# Altium schematic sheet schematic big.SchDoc
size A3; SheetNumber: 1; SheetTotal: 1
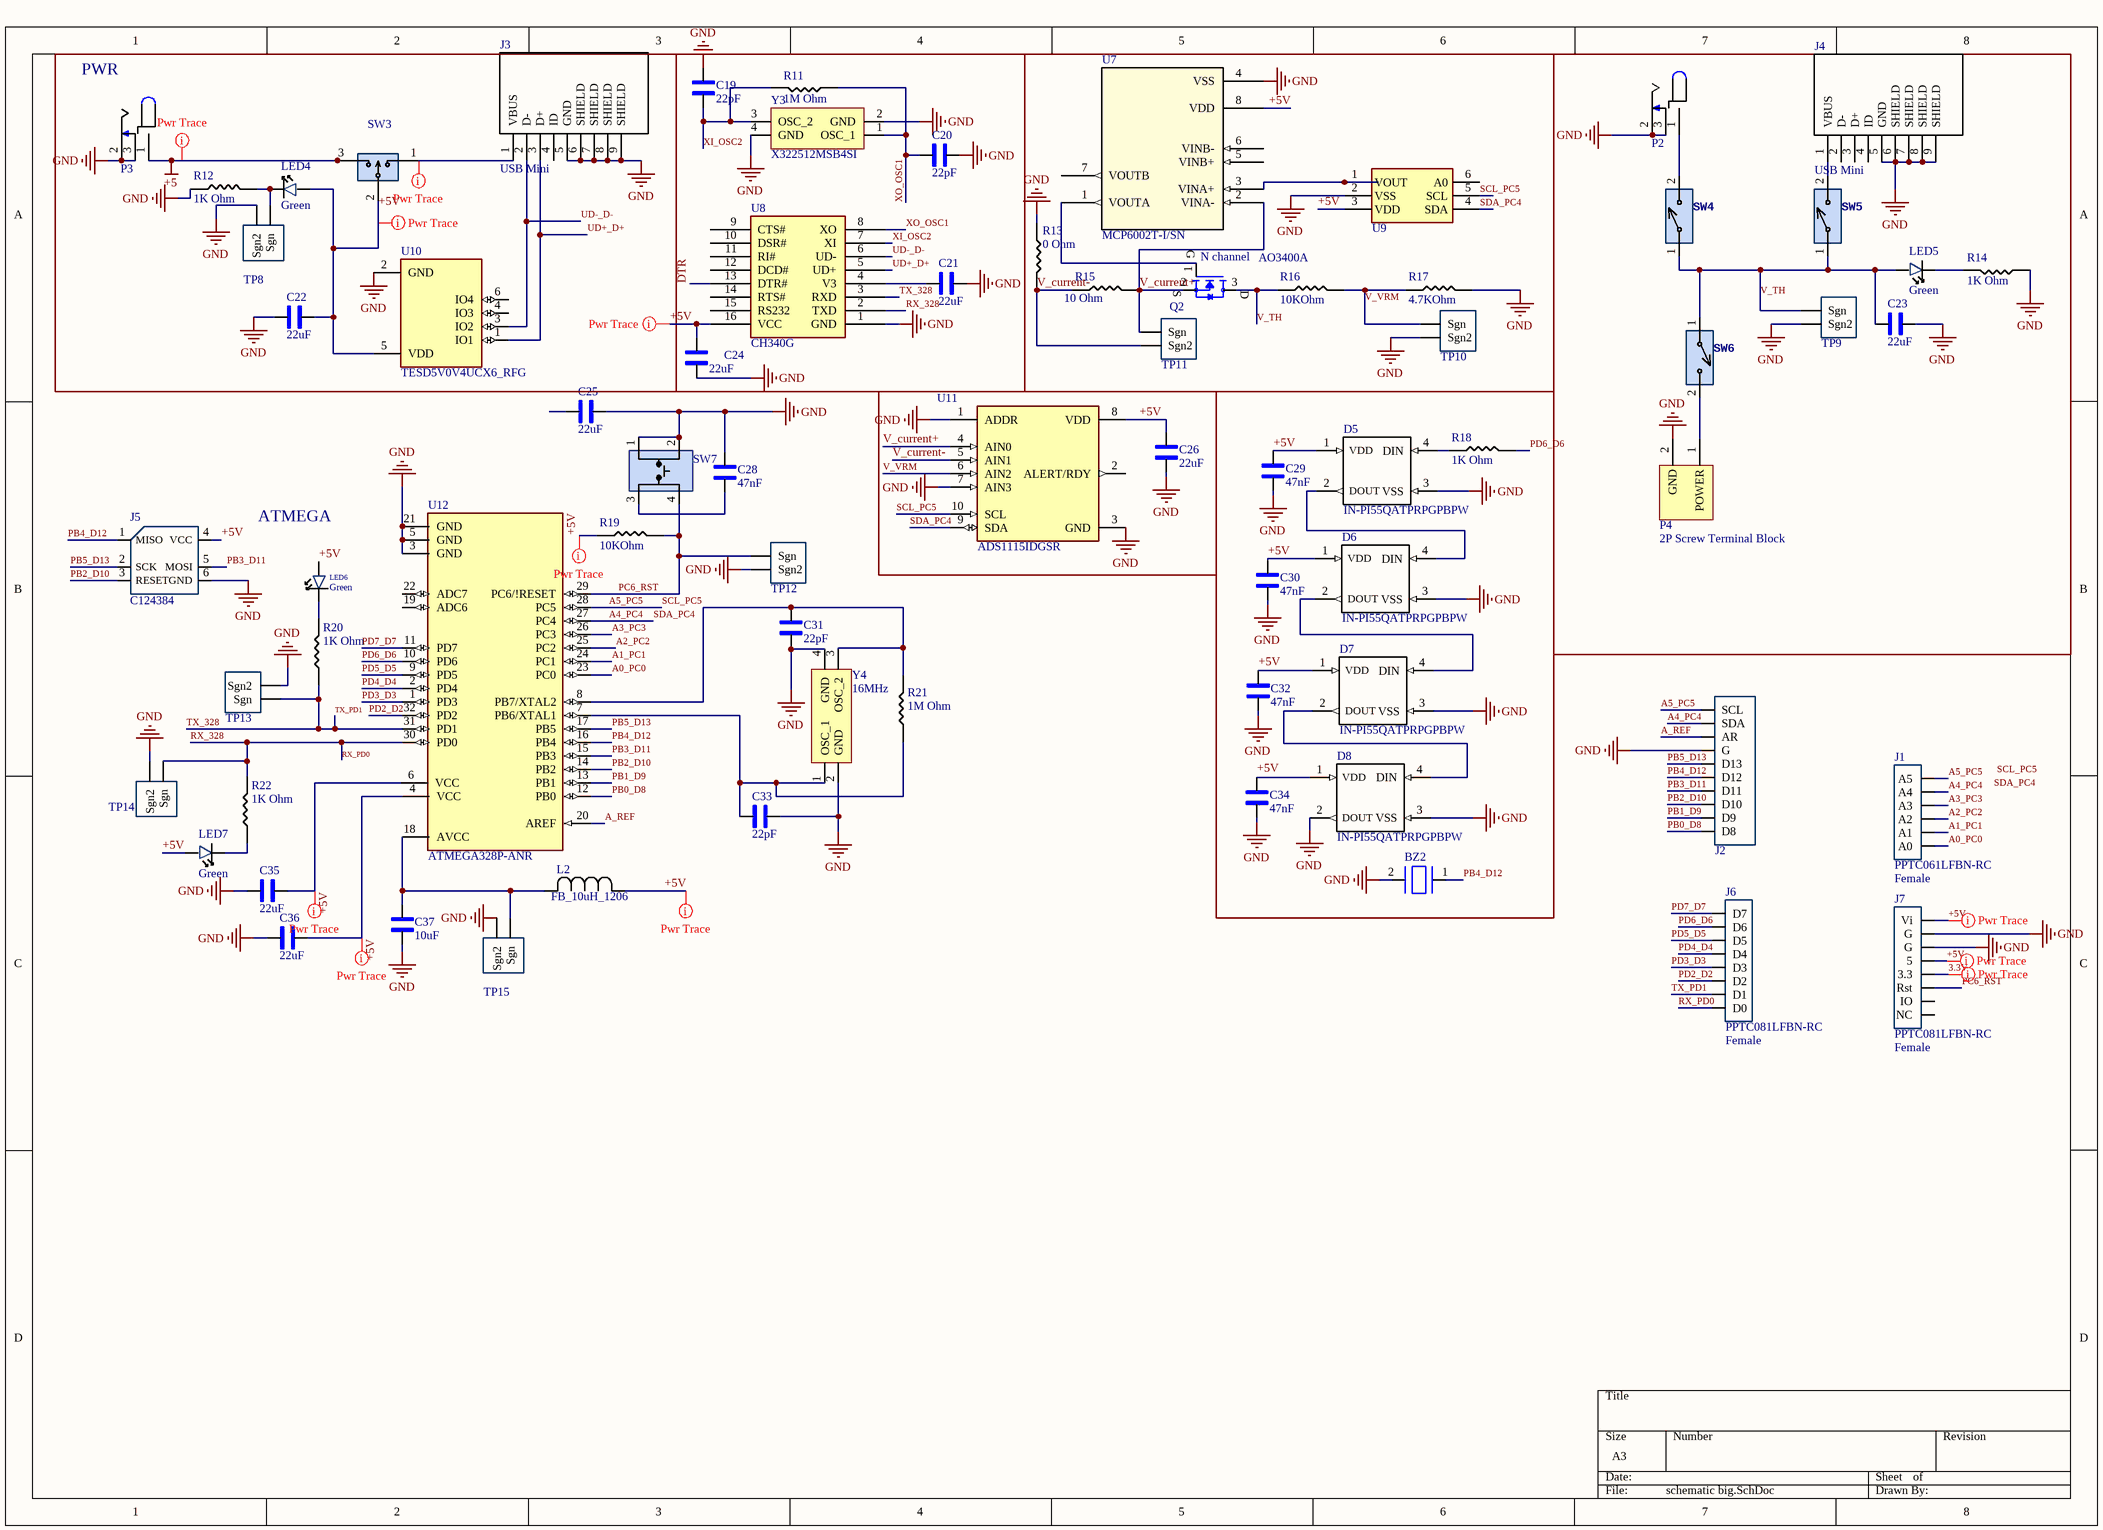
[diagram p0: schematic big.SchDoc]

## Parts
BZ2  AT-1224-TWT-5V-2-R  [BUZZER- TH]  (value not drawn)
C19  22pF  [1206_Passive_Capacitor]
C20  22pF  [1206_Passive_Capacitor]
C21  22uF  [1206_Passive_Capacitor]
C22  22uF  [1206_Passive_Capacitor]
C23  22uF  [1206_Passive_Capacitor]
C24  22uF  [1206_Passive_Capacitor]
C25  22uF  [1206_Passive_Capacitor]
C26  22uF  [1206_Passive_Capacitor]
C28  47nF  [1206_Passive_Capacitor]
C29  47nF  [1206_Passive_Capacitor]
C30  47nF  [1206_Passive_Capacitor]
C31  22pF  [1206_Passive_Capacitor]
C32  47nF  [1206_Passive_Capacitor]
C33  22pF  [1206_Passive_Capacitor]
C34  47nF  [1206_Passive_Capacitor]
C35  22uF  [1206_Passive_Capacitor]
C36  22uF  [1206_Passive_Capacitor]
C37  10uF  [1206_Passive_Capacitor]
D5  IN-PI55QATPRPGPBPW  [SERIAL_LED - duplicate]
D6  IN-PI55QATPRPGPBPW  [SERIAL_LED - duplicate]
D7  IN-PI55QATPRPGPBPW  [SERIAL_LED - duplicate]
D8  IN-PI55QATPRPGPBPW  [SERIAL_LED - duplicate]
J1  PPTC061LFBN-RC  value Female  [6_PIN_ARD-Analog_100mil]
J2  PPTC101LFBN-RC  [10_PIN_ARDUINO_100MIL]  (value not drawn)
J3  USB Mini  [USB_MINI_B]
J4  USB Mini  [USB_MINI_B]
J5  LCSC Part#: C124384  [ICSP]  (hidden comment: NRPN032PAEN-RC)
J6  PPTC081LFBN-RC  value Female  [8_PIN_ARD-DIG_100MIL]
J7  PPTC081LFBN-RC  value Female  [8_PIN_ARD-PWR_100MIL]
L2  FB_10uH_1206  [AIML-1206_ABR-M]
LED4  Green  [LED_1206]
LED5  Green  [LED_1206]
LED6  Green  [LED_1206]
LED7  Green  [LED_1206]
P2  Power Jack  [Power_Jack]  (value not drawn)
P3  Power Jack  [Power_Jack]  (value not drawn)
P4  2P Screw Terminal Block  [P_Terminal block 3.5mm-pitch]
Q2  AO3400A  value N channel  [N-MOSFET]
R11  value 1M Ohm  [1206_Passive_Resitor]  (hidden comment: 1M)
R12  value 1K Ohm  [1206_Passive_Resitor]  (hidden comment: 1k)
R13  0 Ohm  [1206_Passive_Resitor]
R14  value 1K Ohm  [1206_Passive_Resitor]  (hidden comment: 1k)
R15  10 Ohm  [1206_Passive_Resitor]
R16  value 10KOhm  [1206_Passive_Resitor]  (hidden comment: 10k)
R17  4.7KOhm  [1206_Passive_Resitor]
R18  value 1K Ohm  [1206_Passive_Resitor]  (hidden comment: 1k)
R19  value 10KOhm  [1206_Passive_Resitor]  (hidden comment: 10k)
R20  value 1K Ohm  [1206_Passive_Resitor]  (hidden comment: 1k)
R21  value 1M Ohm  [1206_Passive_Resitor]  (hidden comment: 1M)
R22  value 1K Ohm  [1206_Passive_Resitor]  (hidden comment: 1k)
SW3  PREC003SAAN-RC  [3_PIN_100mil]  (value not drawn)
SW4  SW_2Pin_100mil_Switch  [2Pin-Header-Conn]  (value not drawn)
SW5  SW_2Pin_100mil_Switch  [2Pin-Header-Conn]  (value not drawn)
SW6  SW_2Pin_100mil_Switch  [2Pin-Header-Conn]  (value not drawn)
SW7  TL3305AF160QG  [Switch_JLC]  (value not drawn)
TP8  10x Probe TP  [TP_Diff_Probe]  (value not drawn)
TP9  10x Probe TP  [TP_Diff_Probe]  (value not drawn)
TP10  10x Probe TP  [TP_Diff_Probe]  (value not drawn)
TP11  10x Probe TP  [TP_Diff_Probe]  (value not drawn)
TP12  10x Probe TP  [TP_Diff_Probe]  (value not drawn)
TP13  10x Probe TP  [TP_Diff_Probe]  (value not drawn)
TP14  10x Probe TP  [TP_Diff_Probe]  (value not drawn)
TP15  10x Probe TP  [TP_Diff_Probe]  (value not drawn)
U7  MCP6002T-I/SN  [SOIC127P600X175-8N]
U8  CH340G  [USB to serial]
U9  DAC IC  [MCP4725]  (value not drawn)
U10  TESD5V0V4UCX6_RFG  [SOT95P280X145-6N]
U11  ADS1115IDGSR  [ADC_ADS1115IDGSR]
U12  ATMEGA328P-ANR  [ATMega328P]
Y3  X322512MSB4SI  [Crystal resonator]
Y4  value 16MHz  [Crystal resonator]  (hidden comment: X322516MLB4SI)

## Blocks framed on the sheet
PWR: C22 J3 LED4 P3 R12 SW3 TP8 U10

## Nets
+5: P3.1 SW3.3
GND: BZ2.2(BZ2) C19.1 C20.2 C21.1 C22.1 C23.1 C24.1 C25.2 C26.1 C28.2 C29.1 C30.1 C31.1 C32.1 C33.1 C34.1 C35.1 C36.1 C37.1 D5.3(VSS) D6.3(VSS) D7.3(VSS) D8.2(DOUT) D8.3(VSS) J2.4(G) J3.5(GND) J3.6(SHIELD) J3.7(SHIELD) J3.8(SHIELD) J3.9(SHIELD) J4.5(GND) J4.6(SHIELD) J4.7(SHIELD) J4.8(SHIELD) J4.9(SHIELD) J5.6(GND) J7.6(G) J7.7(G) P2.2 P2.3 P3.2 P3.3 P4.2(GND) R12.1 R13.1 R14.1 R17.2 SW7.1 SW7.2 TP8.2(Sgn2) TP9.2(Sgn2) TP10.2(Sgn2) TP12.2(Sgn2) TP13.2(Sgn2) TP14.2(Sgn2) TP15.2(Sgn2) U7.4(VSS) U8.1(GND) U9.2(VSS) U10.2(GND) U11.1(ADDR) U11.3(GND) U11.7(AIN3) U12.3(GND) U12.5(GND) U12.21(GND) Y3.2(GND) Y3.4(GND) Y4.2(GND) Y4.4(GND)
3.3V: J7.4(3.3)
+5V: C22.2 C24.2 C26.2 C29.2 C30.2 C35.2 C36.2 D5.1(VDD) D6.1(VDD) J5.4(VCC) J7.5 J7.8(Vi) L2.1 LED4.1 LED6.1 LED7.1 R19.1 SW3.2 U7.8(VDD) U8.16(VCC) U9.3(VDD) U10.5(VDD) U11.8(VDD) U12.4(VCC) U12.6(VCC)
A0_PC0: J1.1(A0) U12.23(PC0)
A1_PC1: J1.2(A1) U12.24(PC1)
A2_PC2: J1.3(A2) U12.25(PC2)
A3_PC3: J1.4(A3) U12.26(PC3)
A4_PC4: J1.5(A4) J2.2(SDA) U9.4(SDA) U11.9(SDA) U12.27(PC4)  [also labelled SDA_PC4]
A5_PC5: J1.6(A5) J2.1(SCL) U9.5(SCL) U11.10(SCL) U12.28(PC5)  [also labelled SCL_PC5]
A_REF: J2.3(AR) U12.20(AREF)
DTR: U8.13(DTR#)
PB0_D8: J2.10(D8) U12.12(PB0)
PB1_D9: J2.9(D9) U12.13(PB1)
PB2_D10: J2.8(D10) J5.3(RESET) U12.14(PB2)
PB3_D11: J2.7(D11) J5.5(MOSI) U12.15(PB3)
PB4_D12: BZ2.1(BZ1) J2.6(D12) J5.1(MISO) U12.16(PB4)
PB5_D13: J2.5(D13) J5.2(SCK) U12.17(PB5)
PC6_RST: J7.3(Rst) R19.2 SW7.4 TP12.1(Sgn) U12.29(PC6/!RESET)
PD2_D2: J6.6(D2) U12.32(PD2)
PD3_D3: J6.5(D3) U12.1(PD3)
PD4_D4: J6.4(D4) U12.2(PD4)
PD5_D5: J6.3(D5) U12.9(PD5)
PD6_D6: J6.2(D6) R18.2 U12.10(PD6)
PD7_D7: J6.1(D7) U12.11(PD7)
RX_328: J6.8(D0) R22.2 TP14.1(Sgn) U8.2(TXD) U12.30(PD0)  [also labelled RX_PD0]
TX_328: J6.7(D1) R20.1 TP13.1(Sgn) U8.3(RXD) U12.31(PD1)  [also labelled TX_PD1]
UD+_D+: J3.3(D+) U8.5(UD+) U10.1(IO1)
UD-_D-: J3.2(D-) U8.6(UD-) U10.3(IO2)
V_current+: Q2.2(S) R15.2 TP11.1(Sgn) U7.2(VINA-) U11.4(AIN0)
V_current-: R13.2 R15.1 TP11.2(Sgn2) U11.5(AIN1)
V_TH: C23.2 LED5.1 Q2.3(D) R16.1 SW4.1 SW5.1 SW6.1 TP9.1(Sgn)
V_VRM: R16.2 R17.1 TP10.1(Sgn) U11.6(AIN2)
XI_OSC2: C19.2 R11.2 U8.7(XI) Y3.3(OSC_2)
XO_OSC1: C20.1 R11.1 U8.8(XO) Y3.1(OSC_1)
NetC21_2: C21.2 U8.4(V3)
NetC28_1: C28.1 SW7.3
NetC31_2: C31.2 R21.2 U12.8(PB7/XTAL2) Y4.3(OSC_2)
NetC32_2: C32.2 D7.1(VDD)
NetC33_2: C33.2 R21.1 U12.7(PB6/XTAL1) Y4.1(OSC_1)
NetC34_2: C34.2 D8.1(VDD)
NetC37_2: C37.2 L2.2 TP15.1(Sgn) U12.18(AVCC)
NetD5_2: D5.2(DOUT) D6.4(DIN)
NetD5_4: D5.4(DIN) R18.1
NetD6_2: D6.2(DOUT) D7.4(DIN)
NetD7_2: D7.2(DOUT) D8.4(DIN)
NetJ3_1: J3.1(VBUS) SW3.1
NetJ4_1: J4.1(VBUS) SW5.2
NetLED4_2: LED4.2 R12.2 TP8.1(Sgn)
NetLED5_2: LED5.2 R14.2
NetLED6_2: LED6.2 R20.2
NetLED7_2: LED7.2 R22.1
NetP2_1: P2.1 SW4.2
NetP4_1: P4.1(POWER) SW6.2
NetQ2_1: Q2.1(G) U7.1(VOUTA)
NetU7_3: U7.3(VINA+) U9.1(VOUT)

Not connected (* = marked no-connect by the designer): C25 1; J3 4(ID); J4 2(D-) 3(D+) 4(ID); J7 1(NC) 2(IO); U7 5(VINB+) 6(VINB-) 7(VOUTB); U8 9(CTS#) 10(DSR#) 11(RI#) 12(DCD#) 14(RTS#) 15(RS232); U9 6(A0); U10 4(IO3) 6(IO4); U11 2(ALERT/RDY); U12 19(ADC6) 22(ADC7)

## Layout directives
rule Width Constraint [Pref Width = 20mil    Min Width = 10mil    Max Width = 100mil]: 3.3V, +5, +5V, NetJ3_1

## Notes on the sheet
- ATMEGA
- Labels drawn without touching a wire or pin: +5V, SCL_PC5, SDA_PC4

## Library data of the parts
BZ2 = BUZZER_1: Buzzers Transducer, Externally Driven Electromechanical/Magnetic 5 V 40mA 2.4kHz 87dB @ 5V, 10cm Through Hole PC Pins; Datasheet: https://www.puiaudio.com/media/SpecSheet/AT-1224-TWT-5V-2-R.pdf
C19 C20 C31 C33 = C_22pF_1206: 22pF ±5% 1kV C0G 1206 Multilayer Ceramic Capacitors MLCC - SMD/SMT RoHS; MFR Part #: CC1206JKNPOCBN220; Type: Extended; LCSC Part#: C107174; Datasheet: https://datasheet.lcsc.com/lcsc/1810241219_YAGEO-CC1206JKNPOCBN220_C107174.pdf; Value: 22pF
C21-C26 C35 C36 = C_22uF_1206: 22uF ±10% 25V X5R 1206 Multilayer Ceramic Capacitors MLCC - SMD/SMT RoHS; MFR Part #: CL31A226KAHNNNE; Type: basic; LCSC Part#: C12891; Datasheet: https://datasheet.lcsc.com/lcsc/1811031514_Samsung-Electro-Mechanics-CL31A226KAHNNNE_C12891.pdf; Value: 22uF
C28-C30 C32 C34 = C_47nF_1206: 47nF ±5% 50V C0G 1206 Multilayer Ceramic Capacitors MLCC - SMD/SMT RoHS; MFR Part #: GRM31M5C1H473JA01L; Type: Extended; LCSC Part#: C21812; Datasheet: https://datasheet.lcsc.com/lcsc/1810201313_Murata-Electronics-GRM31M5C1H473JA01L_C21812.pdf; Value: 47nF
C37 = C_10uF_1206: 10uF ±10% 50V X5R 1206 Multilayer Ceramic Capacitors MLCC - SMD/SMT RoHS; MFR Part #: CL31A106KBHNNNE; Type: Basic; LCSC Part#: C13585; Datasheet: https://datasheet.lcsc.com/lcsc/1810221112_Samsung-Electro-Mechanics-CL31A106KBHNNNE_C13585.pdf; Value: 10uF
D5-D8 = LED_Smart: LIGHT EMITTING DIODES (LED) RGB 620~630NM RED, 520~530NM GREEN, 465~475NM BLUE 600MCD@16MARED,1200MCD@16MAGREEN,300MCD@16MABLUE TOP VIEW SMD-4 ROHS; MFR Part #: XL-5050RGBC-WS2812B; Manufacturer: XINGLIGHT; LCSC Part#: C2843785; DataSheet: https://datasheet.lcsc.com/lcsc/2301111130_XINGLIGHT-XL-5050RGBC-WS2812B_C2843785.pdf
J1 = JF_6_PIN_FEMA_ARD-Anolog: 6 Position Header Connector 0.100" (2.54mm) Through Hole Tin; Digikey Link: https://www.digikey.com/product-detail/en/PPTC061LFBN-RC/S7004-ND/810145/?itemSeq=304982353; MFR Part #: PPTC061LFBN-RC; LCSC Part#: C40877; Type: Extended
J2 = JF_10_PIN_FEMA_ARDUINO: 10 Position Header Connector 0.100" (2.54mm) Through Hole Tin; Value: Female; Digikey Link: https://www.digikey.com/product-detail/en/PPTC101LFBN-RC/S7008-ND/810149/?itemSeq=304982352; MFR Part #: PPTC101LFBN-RC; LCSC Part#: C225507; Type: Extended
J3 J4 = J_USB_B_Mini: Through Hole USB Connectors RoHS; MFR Part #: 920-462A2021D10102; Value: USB mini B; LCSC Part#: C46398; Datasheet: https://datasheet.lcsc.com/szlcsc/2103081233_Jing-Extension-of-the-Electronic-Co-920-462A2021D10102_C46398.pdf; Type: Extended
J5 = J_ICSP: Connector Header Through Hole 6 position 0.079" (2.00mm); Digikey Link: https://www.digikey.com/product-detail/en/NRPN032PAEN-RC/S5801-03-ND/804955/?itemSeq=304982355; MFR Part #: NRPN032PAEN-RC; Type: Extended
J6 = JF_8_PIN_FEMA_ARD-Dig: 8 Position Header Connector 0.100" (2.54mm) Through Hole Tin; Digikey Link: https://www.digikey.com/product-detail/en/PPTC081LFBN-RC/S7006-ND/810147/?itemSeq=304982354; MFR Part #: PPTC081LFBN-RC; Type: Extended; LCSC Part#: C27438
J7 = JF_8_PIN_FEMA_ARD-Pwr: 8 Position Header Connector 0.100" (2.54mm) Through Hole Tin; Digikey Link: https://www.digikey.com/product-detail/en/PPTC081LFBN-RC/S7006-ND/810147/?itemSeq=304982354; MFR Part #: PPTC081LFBN-RC; Type: Extended; LCSC Part#: C27438
L2 = FB_10uH_1206: 25mA 10uH ±10% 800mΩ 1206  Inductors (SMD) ROHS; Mfr_Name: FH (Guangdong Fenghua Advanced Tech); MFR PART #: CMI321609X100KT; Type: Basic; LCSC PART#: C1051; DataSheet: https://datasheet.lcsc.com/lcsc/1810311314_FH--Guangdong-Fenghua-Advanced-Tech-CMI321609X100KT_C1051.pdf
LED4-LED7 = LED_GREEN_1206: Green 513~528nm 1206 Light Emitting Diodes (LED) RoHS; MFR Part #: SZYY1206G; Type: Extended; LCSC Part#: C434439; Datasheet: https://datasheet.lcsc.com/lcsc/2006301532_Yongyu-Photoelectric-SZYY1206G_C434439.pdf; Value: Green
P2 P3 = P_Power Jack: Power Barrel Connector Jack 2.10mm ID (0.083"), 5.50mm OD (0.217") Through Hole, Right Angle; MFR Part #: PJ-102A; Value: CONN PWR JACK 2X5.5MM SOLDER; Digikey Link: https://www.digikey.com/product-detail/en/PJ-102A/CP-102A-ND/275425/?itemSeq=304982367; LCSC Part#: C136744; Type: Extended
P4 = P_Terminal block: Green Straight pin 3.5mm  pitch; P=3.5mm  Screw terminal ROHS; MFR Part #: KF350-3.5-2P; Manufacturer: Cixi Kefa Elec; LCSC Part#: C474892; DataSheet: https://datasheet.lcsc.com/lcsc/2001160007_Cixi-Kefa-Elec-KF350-3-5-2P_C474892.pdf
Q2 = Q_Nch_MOSFET: MOSFET N Trench 30V 5.7A 1.5V @ 250uA 26.5 m? @ 5.7A,10V SOT-23-3L RoHS; Type: Basic; LCSC Part#: C20917; Datasheet: https://datasheet.lcsc.com/szlcsc/Alpha-Omega-Semicon-AOS-AO3400A_C20917.pdf; MFR Part #: AO3400A
R11 R21 = R_1M_1206: CHIP RESISTOR - SURFACE MOUNT 1MOHMS ±1% 1/4W 1206 ROHS; MFR Part #: RMCF1206JT1M00; Digikey Link: https://www.digikey.com/product-detail/en/RMCF1206JT1M00/RMCF1206JT1M00CT-ND/1942830/?itemSeq=304982358; LCSC Part#: C17927; Type: Basic
R12 R14 R18 R20 R22 = R_1K_1206: CHIP RESISTOR - SURFACE MOUNT 1KOHMS ±1% 1/4W 1206 ROHS; MFR Part #: RNCP1206FTD1K00CT; Digikey Link: https://www.digikey.com/product-detail/en/RNCP1206FTD1K00/RNCP1206FTD1K00CT-ND/2240675/?itemSeq=304982373; LCSC Part#: C4410; Type: Basic
R13 = R_0Ohm_1206: CHIP RESISTOR - SURFACE MOUNT 0OHMS ±1% 1/4W 1206 ROHS; MFR Part #: 1206W4F0000T5E; Datasheet: https://datasheet.lcsc.com/szlcsc/Uniroyal-Elec-1206W4F0000T5E_C17888.pdf; LCSC Part#: C17888; Type: Basic; Mouser link: https://www.mouser.com/ProductDetail/Royalohm/1206W4F0000T5E?qs=e8oIoAS2J1Thbopin%252BsagQ%3D%3D; Value: 0 Ohm
R15 = R_10Ohm_1206: CHIP RESISTOR - SURFACE MOUNT 0.1OHMS ±1% 1/4W 1206 ROHS; MFR Part #: 1206W4F100JT5E; Datasheet: https://datasheet.lcsc.com/szlcsc/Uniroyal-Elec-1206W4F100JT5E_C17903.pdf; LCSC Part#: C17903; Type: Basic; Value: 10 Ohm
R16 R19 = R_10KOhm_1206: 10 kOhms ±5% 0.25W, 1/4W Chip Resistor 1206 (3216 Metric) Automotive AEC-Q200 Thick Film; MFR Part #: RMCF1206FT10K0; Digikey Link: https://www.digikey.com/en/products/detail/stackpole-electronics-inc/RMCF1206FT10K0/1759669; LCSC Part#: C17902; Type: Basic
R17 = R_4.7k_1206: 4.7kΩ ±1% 0.25W ±100ppm/℃ 1206 Chip Resistor - Surface Mount RoHS; MFR Part #: 1206W4F4701T5E; LCSC Part#: C17936; Datasheet: https://datasheet.lcsc.com/lcsc/1810301414_UNI-ROYAL-Uniroyal-Elec-1206W4F4701T5E_C17936.pdf; Type: Basic; Value: 4.7KOhm
SW3 = SW_3Pin_100mil_Switch: Connector Header Through Hole 3 position 0.100" (2.54mm); Value: CONN HEADER VERT 3POS 2.54MM; Digikey Link: https://www.digikey.com/product-detail/en/PREC003SAAN-RC/S1012EC-03-ND/2774851/?itemSeq=304982371; MFR Part #: PREC003SAAN-RC; Type: Extended; LCSC Part#: C49257
SW4-SW6 = SW_2Pin_100mil_Switch: 2Pin Header; LCSC Part#: C124375; Type: Extended
SW7 = SW_Push_Button_JLC: Tactile Switch SPST-NO Top Actuated Surface Mount; MFR Part #: KH-4.5X4.5X4.3H-STM; LCSC Part#: C2837550; Type: Extended; DataSheet: https://datasheet.lcsc.com/lcsc/2106081532_Shenzhen-Kinghelm-Elec-KH-4.5X4.5X4.3H-STM_C2837550.pdf
TP8-TP15 = TP_Diff_Probe: Test Point 300 mil centers
U7 = U_MCP6002T-I/SN: 0.6 V/us 2 1MHz 1.8V ~ 6V 100μA General Purpose SOIC-8_150mil  Operational Amplifier ROHS; Mfr: Microchip; MFR Part #: MCP6002T-I/SN; DataSheet: https://ww1.microchip.com/downloads/en/DeviceDoc/MCP6001-1R-1U-2-4-1-MHz-Low-Power-Op-Amp-DS20001733L.pdf; LCSC Part#: C7377; Type: Basic
U8 = U_USBtoSerial: Transceiver USB 2.0 2Mbps SOP-16_150mil USB ICs RoHS; Datasheet: https://datasheet.lcsc.com/lcsc/2008191806_WCH-Jiangsu-Qin-Heng-CH340G_C14267.pdf; LCSC Part#: C14267; MFR Part #: CH340G; Type: Basic; Value: USB to Serial
U9 = U_MCP4725A0T-E/CH: IC DAC 12BIT V-OUT SOT23-6; Datasheet: https://ww1.microchip.com/downloads/en/DeviceDoc/22039d.pdf; LCSC Part#: C144198; type: Extended; MFR Part #: MCP4725A0T-E/CH
U10 = TESD5V0V4UCX6_RFG: SOT-26, 5V, 75W, 0.6pF, ESD Protection; MF: Taiwan Semiconductor; MP: TESD5V0V4UCX6 RFG; SnapEDA_Link: https://www.snapeda.com/parts/TESD5V0V4UCX6%20RFG/Taiwan+Semiconductor/view-part/?ref=snap; Package: None; Value: *; Check_prices: https://www.snapeda.com/parts/TESD5V0V4UCX6%20RFG/Taiwan+Semiconductor/view-part/?ref=eda
U11 = U_ADC_ADS1115IDGSR: 16-Bit ADC with Integrated MUX, PGA, Comparator, Oscillator, and Reference 10-VSSOP -40 to 125; MFR Part #: ADS1115IDGSR; Package: MSOP-10 Texas Instruments; LCSC Part#: C37593; SnapEDA_Link: https://www.snapeda.com/parts/ADS1115IDGSR/Texas%20Instruments/view-part/?ref=snap; Type: Extended; DigiKey link: https://www.digikey.com/product-detail/en/texas-instruments/ADS1115IDGSR/296-38849-1-ND/5142969?utm_source=snapeda&utm_medium=aggregator&utm_campaign=symbol; Value: *
U12 = U_ATMega328P: AVR AVR® ATmega Microcontroller IC 8-Bit 20MHz 32KB (16K x 16) FLASH 32-TQFP (7x7); MFR Part #: ATMEGA328P-AU; Value: IC MCU 8BIT 32KB FLASH 32TQFP; Digikey Link: https://www.digikey.com/product-detail/en/ATMEGA328P-ANR/ATMEGA328P-ANRCT-ND/2774230/?itemSeq=304982365; LCSC Part#: C14877; Type: Basic
Y3 = X_12MHz_Res: SMD Crystal Resonators 12MHz ±10ppm SMD-3225_4P RoHS; LCSC Part#: C9002; MFR Part #: X322512MSB4SI; Value: 12MHz; Type: Basic; Datasheet: https://datasheet.lcsc.com/szlcsc/Yangxing-Tech-X322512MSB4SI_C9002.pdf
Y4 = X_16Mhz_Res: ±10ppm 16000000Hz -40℃~85℃ 贴片无源晶振 60Ω 9pF SMD3225-4P Crystals ROHS; LCSC Part#: C13738; MFR Part #: X322516MLB4SI; Type: Basic